# Altium schematic sheet Main.SchDoc
size A3
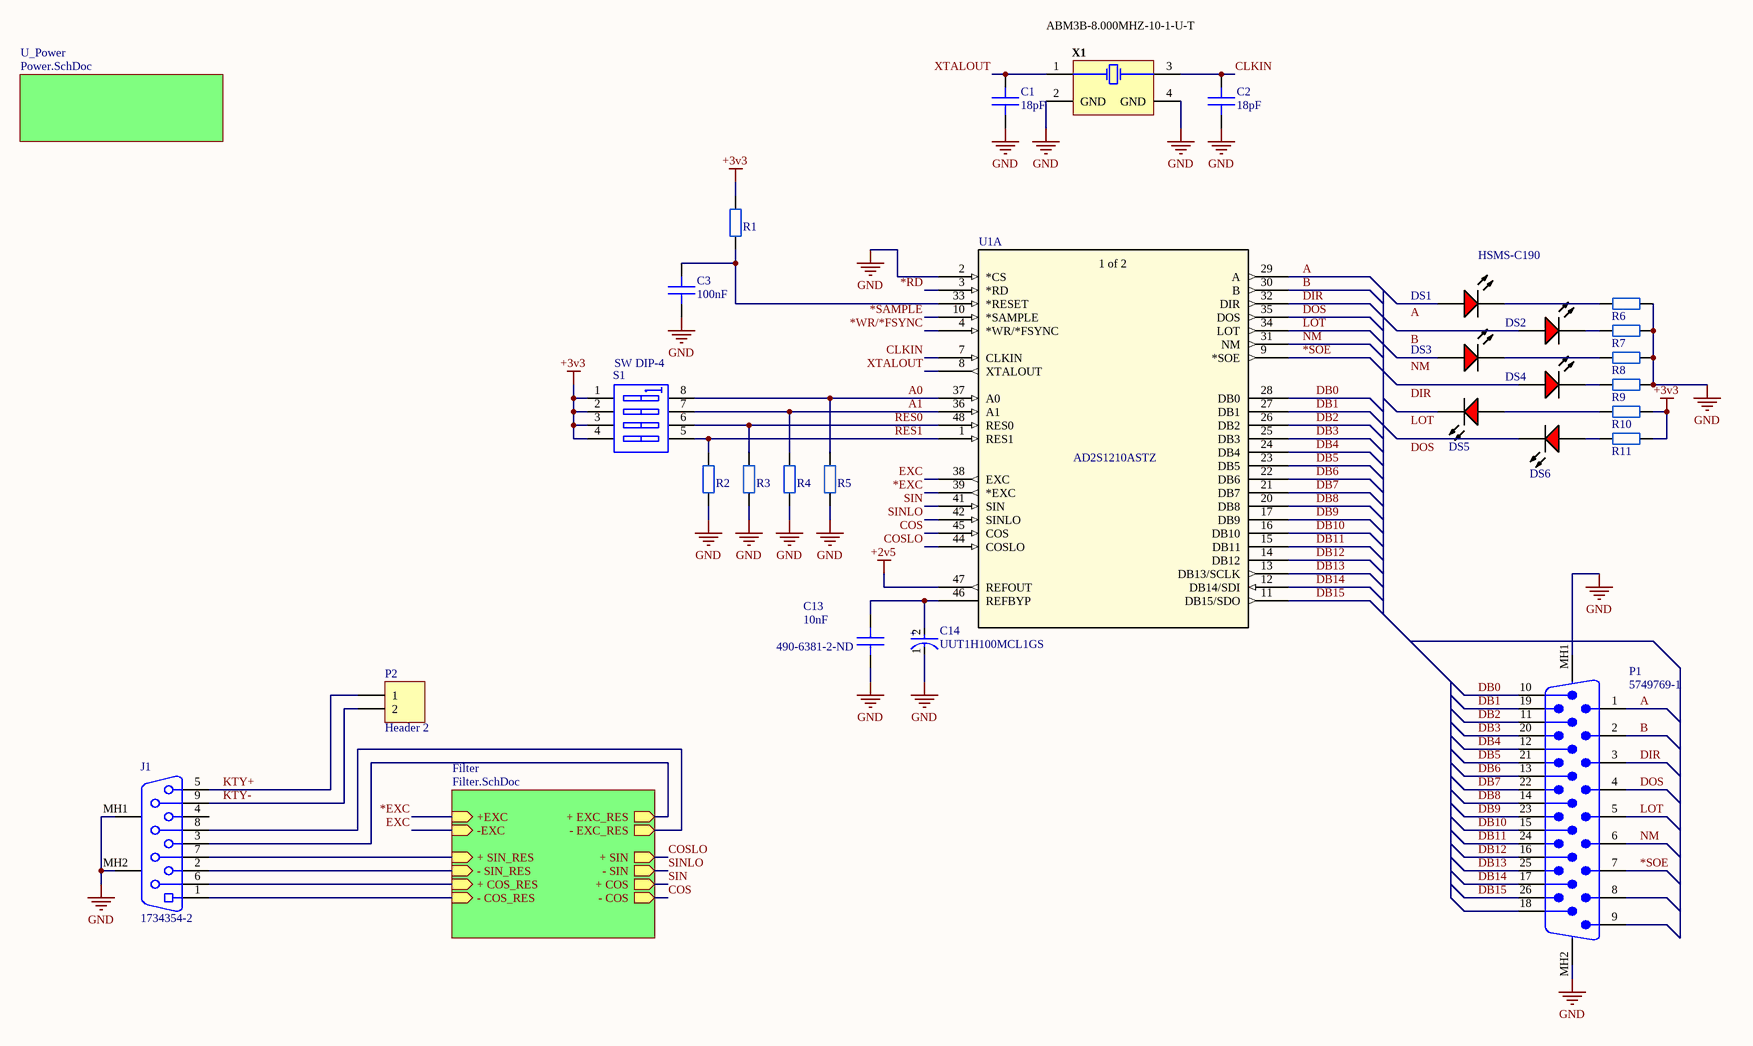
[diagram p0: Main.SchDoc]

## Parts
C1  value 18pF  [C0603 (1608)]  (hidden comment: Cap SMD)
C2  value 18pF  [C0603 (1608)]  (hidden comment: Cap SMD)
C3  value 100nF  [C0603 (1608)]  (hidden comment: Cap SMD)
C13  value 10nF  Supplier Part Number 1: 490-6381-2-ND  [C0603 (1608)]  (hidden comment: Cap SMD)
C14  UUT1H100MCL1GS  [FP-UUT1H100MCL1GS-MFG]
DS1  HSMS-C190  [AVAG-HSMX-C190_V]
DS2  HSMS-C190  [AVAG-HSMX-C190_V]  (value not drawn)
DS3  HSMS-C190  [AVAG-HSMX-C190_V]  (value not drawn)
DS4  HSMS-C190  [AVAG-HSMX-C190_V]  (value not drawn)
DS5  HSMS-C190  [AVAG-HSMX-C190_V]  (value not drawn)
DS6  HSMS-C190  [AVAG-HSMX-C190_V]  (value not drawn)
J1  1734354-2  [TECO-1734354-2_V]
P1  5749769-1  [TECO-5749769-1_V]
P2  Header 2  [HDR1X2]
R1  Res  [R0603 (1608)]  (value not drawn)
R2  Res  [R0603 (1608)]  (value not drawn)
R3  Res  [R0603 (1608)]  (value not drawn)
R4  Res  [R0603 (1608)]  (value not drawn)
R5  Res  [R0603 (1608)]  (value not drawn)
R6  1K  [R0603 (1608)]  (value not drawn)
R7  1K  [R0603 (1608)]  (value not drawn)
R8  1K  [R0603 (1608)]  (value not drawn)
R9  1K  [R0603 (1608)]  (value not drawn)
R10  1K  [R0603 (1608)]  (value not drawn)
R11  1K  [R0603 (1608)]  (value not drawn)
S1  SW DIP-4  [SO8_M]
U1  AD2S1210ASTZ  [ST_48_ADI]  (part A of 2)
X1  ABM3B-8.000MHZ-10-1-U-T  [ABRA-ABM3B_V]

## Sub-sheets
Filter = Filter.SchDoc: +EXC (in), -EXC (in), + SIN_RES (in), - SIN_RES (in), + COS_RES (in), - COS_RES (in), + EXC_RES (out), - EXC_RES (out), + SIN (out), - SIN (out), + COS (out), - COS (out)
U_Power = Power.SchDoc: no entries

## Nets
+2v5: U1.47(REFOUT)
+3v3: R1.2 R10.2 R11.2 S1.1(A1) S1.2(A2) S1.3(A3) S1.4(A4)
GND: C1.1 C2.1 C3.1 C13.1 C14.1(C) J1.MH1 J1.MH2 P1.MH1 P1.MH2 R2.1 R3.1 R4.1 R5.1 R6.2 R7.2 R8.2 R9.2 U1.2(*CS) X1.2(GND) X1.4(GND)
*EXC: U1.39(*EXC) ; sheet Filter/+EXC
*RD: U1.3(*RD)
*SAMPLE: U1.10(*SAMPLE)
*SOE: P1.7 U1.9(*SOE)
*WR/*FSYNC: U1.4(*WR/*FSYNC)
A: DS1.1(A) P1.1 U1.29(A)
A0: R5.2 S1.8(B1) U1.37(A0)
A1: R4.2 S1.7(B2) U1.36(A1)
B: DS2.1(A) P1.2 U1.30(B)
CLKIN: C2.2 U1.7(CLKIN) X1.3(X2)
COS: U1.45(COS) ; sheet Filter/- COS
COSLO: U1.44(COSLO) ; sheet Filter/+ SIN
DB0: P1.10 U1.28(DB0)
DB1: P1.19 U1.27(DB1)
DB2: P1.11 U1.26(DB2)
DB3: P1.20 U1.25(DB3)
DB4: P1.12 U1.24(DB4)
DB5: P1.21 U1.23(DB5)
DB6: P1.13 U1.22(DB6)
DB7: P1.22 U1.21(DB7)
DB8: P1.14 U1.20(DB8)
DB9: P1.23 U1.17(DB9)
DB10: P1.15 U1.16(DB10)
DB11: P1.24 U1.15(DB11)
DB12: P1.16 U1.14(DB12)
DB13: P1.25 U1.13(DB13/SCLK)
DB14: P1.17 U1.12(DB14/SDI)
DB15: P1.26 U1.11(DB15/SDO)
DIR: DS4.1(A) P1.3 U1.32(DIR)
DOS: DS6.2(K) P1.4 U1.35(DOS)
EXC: U1.38(EXC) ; sheet Filter/-EXC
KTY+: J1.5 P2.1
KTY-: J1.9 P2.2
LOT: DS5.2(K) P1.5 U1.34(LOT)
NM: DS3.1(A) P1.6 U1.31(NM)
RES0: R3.2 S1.6(B3) U1.48(RES0)
RES1: R2.2 S1.5(B4) U1.1(RES1)
SIN: U1.41(SIN) ; sheet Filter/+ COS
SINLO: U1.42(SINLO) ; sheet Filter/- SIN
XTALOUT: C1.2 U1.8(XTALOUT) X1.1(X1)
NetC3_2: C3.2 R1.1 U1.33(*RESET)
NetC13_2: C13.2 C14.2(A) U1.46(REFBYP)
NetDS1_2: DS1.2(K) R6.1
NetDS2_2: DS2.2(K) R7.1
NetDS3_2: DS3.2(K) R8.1
NetDS4_2: DS4.2(K) R9.1
NetDS5_1: DS5.1(A) R10.1
NetDS6_1: DS6.1(A) R11.1
NetJ1_1: J1.1 ; sheet Filter/- COS_RES
NetJ1_2: J1.2 ; sheet Filter/- SIN_RES
NetJ1_3: J1.3 ; sheet Filter/+ EXC_RES
NetJ1_6: J1.6 ; sheet Filter/+ COS_RES
NetJ1_7: J1.7 ; sheet Filter/+ SIN_RES
NetJ1_8: J1.8 ; sheet Filter/- EXC_RES

Not connected (* = marked no-connect by the designer): J1 4; P1 8 9 18

## Notes on the sheet
- (in symbol AD2S1210ASTZ, part A) 1 of 2
- (in symbol CMP-12462-000014-1) +

## Library data of the parts
C13 = Cap SMD: Multilayer Ceramic Capacitors MLCC - SMD/SMT 2200pF 50Volts 2%; Manufacturer: Murata; Manufacturer Part Number: GRM1885C1H222GA01D; Capacitance: 2.2nF; Voltage Rating: 50V; Dielectric: C0G; Supplier 1: Digi-Key; RoHS: Yes; Category: Ceramic Capacitors; Stock 1: 28000; Pricing 1: 4000=0,03542 (USD); Mount: Surface Mount; Case/Package: 0603; Case Code (Metric): 1608; Case Code (Imperial): 0603; Min Operating Temperature: -55°C; Max Operating Temperature: 125°C; Package Quantity: 4000; Tolerance: 2%; Packaging: Tape and Reel; Termination: SMD/SMT; Voltage Rating (DC): 50V; Voltage: 50V; Series: GRM; Construction: Flat; Length: 1.6mm; Width: 0.031inch; Height: 0.8mm; Thickness: 0.035inch; Depth: 0.8mm; Radiation Hardening: No; Lead Free: Lead Free; RoHS Compliant: Yes; ComponentLink1URL: https://datasheet.ciiva.com/11620/c02e-11620874.pdf?src-supplier=Avnet; ComponentLink1Description: https://datasheet.ciiva.com/11620/c02e-11620874.pdf?src-supplier=Avnet; ComponentLink2URL: https://datasheet.ciiva.com/5426/c02e-5426991.pdf?src-supplier=Mouser; ComponentLink2Description: https://datasheet.ciiva.com/5426/c02e-5426991.pdf?src-supplier=Mouser; ComponentLink3URL: https://datasheet.ciiva.com/6264/partnumbering-e-01-6264223.pdf?src-supplier=Digi-Key; ComponentLink3Description: https://datasheet.ciiva.com/6264/partnumbering-e-01-6264223.pdf?src-supplier=Digi-Key
C14 = CMP-12462-000014-1: CAP ALUM 10UF 20% 50V SMD; Lead Diameter: 0.8mm; Dissipation Factor: 0.12%; Ripple Current: 30mA; Dielectric Material: Aluminium; Leakage Current: 3uA; Life (Hours): 2000Hour; Height: 5.8mm; Lead Free: Lead Free; Mount: Surface Mount; Diameter: 6.3mm; Voltage Rating: 50V; Packaging: Tape and Reel; Case/Package: SMD/SMT; REACH SVHC: No SVHC; Height - Seated (Max): 0.24inch; Capacitance: 10uF; Lead Pitch: 2.2mm; Voltage Rating (DC): 50V; Voltage: 50V; Radiation Hardening: No; Package Quantity: 1; Length: 5.8mm; Ripple Current (AC): 30mA; Number of Pins: 2; Width: 6.6mm; Features: General Purpose; Termination: SMD/SMT; Tolerance: 20%; Max Operating Temperature: 105°C; Min Operating Temperature: -55°C
DS1-DS6 = CMP-2000-06427-1: LED Uni-Color Red, 52 mW, 20 mA, -40 to 85 degC, 2-Pin SMD, RoHS, Tape and Reel; Manufacturer: Avago; Reverse Voltage: 5V; Viewing Angle: 170deg; High Brightness: No; Lens Type: ColorlessDiffused; DELETED: Compliant; Product Height (mm): 0.8mm; Dominant Wave Length: 626nm; Number of  Elements: 1; Chip Material: GaP; Lum Intensity: 10mcd; Product Length (mm): 1.6mm; Forward Voltage: 2.6V; Power Dissipation: 52W; Shape Type: Rectangular; Forward Current: 25mA; Peak Wavelength: 630nm; Test Current (It): 20mA; Main Category: ChipLED; Lens Dimensions: 1x0.8x0.5mm; Pin Count: 2; Package Reference: HSMX-C190; Mounting Technology: SurfaceMount; Mounting: SurfaceMount; Datasheet URL: http://docs.avagotech.com/docs/AV02-0551EN; Package Type: ChipLed; Operating Temperature Classification: Industrial; Datasheet Version: 03/2012; Operating Temp Range: -40Cto85C; Emitting Color: Red; Rad Hardened: No; Manufacturer URL: http://www.avagotech.com/; Luminous Intensity: 10mcd; Package Description: 2-Pin Surface Mount Device, Body 1.6 x 0.8 mm, Height 0.9 mm; Type: Uni-Color; Packaging: TapeandReel; Product Depth (mm): 0.8mm
J1 = CMP-2000-05500-1: Female D-Sub Connector, Pitch 2.77 mm, 9 Position, Height 12.75 mm, Tail Length 3.2 mm, -55 to 105 degC, RoHS, Tray; Manufacturer: TE Connectivity; Product Training Modules: AMPLIMITED-SubConnectors; Flange Feature: MatingSide;FemaleScrewlock(4-40); Connector Type: Receptacle,FemaleSockets; 3D Model: 1734354-2.pdf; Dynamic Catalog: AMPLIMITEHD-20Series; Featured Product: AMPLIMITED-SubminiatureConnectors; Number of Positions: 9; Other Names: A35108; Current Rating: 2A; Voltage Rating: 250V; Mating Products: AML09B-ND / -CONND-SUBPLUG9POSGOLD; Catalog Drawings: AMPD-SubMale.318; Housing Material: Polyamide(PA9T),Nylon9T,GlassFilled; Connector Style: D-Sub; Datasheet Version: Rev. A1, 03/2011; Category: Connectors,Interconnects; Shell Material, Finish: Steel,NickelPlated; Standard Package: 90; Color: Black; Contact Finish: Gold; Contact Type: Signal; Contact Finish Thickness: 15µin(0.38µm); Datasheet URL: http://www.te.com/commerce/DocumentDelivery/DDEController?Action=showdoc&DocId=Customer+Drawing%7F1734354%7FA1%7Fpdf%7FEnglish%7FENG_CD_1734354_A1.pdf%7F1734354-2; Mounting Type: ThroughHole,RightAngle; Features: BoardLock; RoHS Information: 1734354-2StatementofCompliance; Series: AMPLIMITEHD-20; Number of Rows: 2; Termination: Solder; Package Description: Female D-Sub Connector, Pitch 2.77 mm, 9 Position, Height 12.75 mm, Tail Length 3.2 mm; Mounting Technology: ThroughHole; Shell Size, Connector Layout: 1(DE,E); Family: D-SubConnectors; Manufacturer URL: http://www.te.com/; Operating Temperature: -55°C~105°C; Package Reference: 1734354-2
P1 = CMP-2000-07625-1: High Density Plug, Pitch 2.29 mm, 26 Position, Height 12.88 mm, Tail Length 3.18 mm, -55 to 105 degC, RoHS, Tray; Manufacturer: TEConnectivity; Max Voltage Rating (AC): 250V; Approvals: UL; Plating: Nickel; Body Material: Metal; Current Rating: 2A; Voltage Rating: 125V; Gender: Male; Datasheet URL: https://media.digikey.com/pdf/Data%20Sheets/Tyco%20Electonics%20AMP%20PDFs/5749769_Dwg.pdf; Package Reference: 5749769-1; Colour: Black; REACH SVHC: Unknown; Flammability Rating: UL94V-0; Case\/Package: Metal; Number of Terminals: 26; Max Operating Temperature: 105degC; Radiation Hardening: No; Min Operating Temperature: -55degC; RoHSCompliant: true; Insulation Material: Thermoplastic; Datasheet Version: Rev. B2, 12/2015; Material: Metal; Mounting Technology: ThroughHole; Lead Free: LeadFree; Manufacturer URL: http://www.te.com/; Package Description: High Density Plug, Pitch 2.29 mm, 26 Position, Height 12.88 mm, Tail Length 3.18 mm; Contact Plating: Gold; ELV: Compliant; Mount: ThroughHole
P2 = Header 2: Header, 2-Pin; LatestRevisionDate: 17-Jul-2002; LatestRevisionNote: Re-released for DXP Platform.; Publisher: Altium Limited
R1-R11 = Resistor EU
S1 = SW DIP-4: DIP Switch, 4 Position, SPST; Published: 24-Mar-1999; LatestRevisionDate: 29-May-2009; LatestRevisionNote: IPC-7351 Footprint Added.; PackageVersion: Dec-2002; PackageReference: SO8; Publisher: Altium Limited; PackageDescription: 8-Pin Small Outline Integrated Circuit 1.27 mm Pitch; Code_JEDEC: MS-012-AA; Code_IPC: SOIC127P600-8
U1 = AD2S1210ASTZ: No Description Available; SourceLibrary: Analog_2015-12-15; Built_By: EMA_UL_Team; Vendor: Analog Devices Inc; Manufacturer_Part_Number: AD2S1210ASTZ; Copyright: Copyright (C) 2018 Accelerated Designs. All rights reserved; RefDes: RefDes; Type: DEV
X1 = CMP-2000-05730-1: Ceramic Crystal, 8 MHz, +/- 10 ppm, -10 to 60 degC, 4-Pin SMD, RoHS, Tape and Reel; Manufacturer: Abracon-LLC; ESR (Equivalent Series Resistance): 200Ohm; Frequency: 8MHz; Frequency Tolerance: ±10ppm; Operating Mode: Fundamental; Load Capacitance: 10pF; Ratings: -; Mounting Type: SurfaceMount; Type: MHzCrystal; Height: 0.043"(1.10mm); Operating Temperature: -10°C~60°C; Package / Case: 4-SMD,NoLead(DFN,LCC); Family: Crystals; Category: CrystalsandOscillators; Frequency Stability: ±10ppm; Mounting Technology: SurfaceMount; Datasheet URL: http://www.abracon.com/Resonators/abm3b.pdf; Datasheet Version: 08/2015; Manufacturer URL: http://www.abracon.com/; Series: ABM3B; Packaging: Tape&amp;Reel(TR); Package Reference: ABM3B; Package Description: 4-Pin Surface Mount Device, Body 5 x 3.2 mm; Size / Dimension: 0.197"Lx0.126"W(5.00mmx3.20mm)